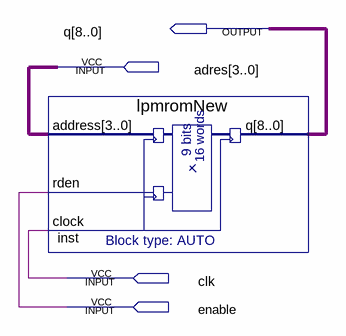
[diagram p0: schematic sheet]
// Quartus schematic 2015510012_hw2.bdf as structural Verilog: 1 symbols, 4 pins
module \2015510012_hw2  (
  input  [3:0] adres,
  input  clk,
  input  enable,
  output [8:0] q
);

  lpmromNew inst (.address(adres), .rden(enable), .clock(clk), .q(q));
endmodule
